# EAGLE design TSAL-GLV (EAGLE 9.4.0)
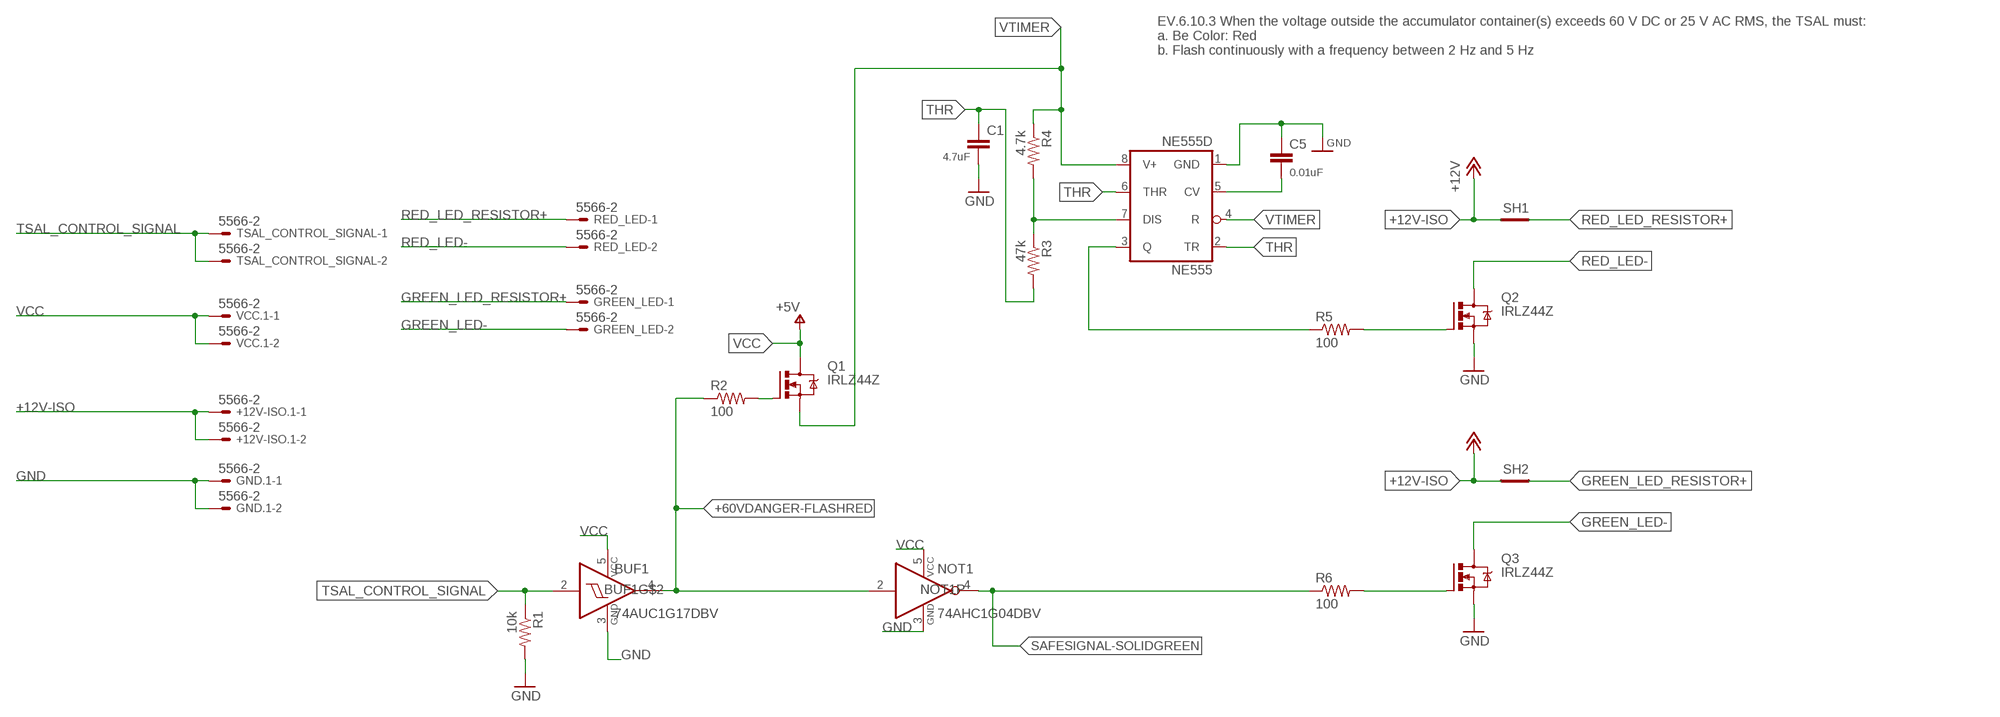
[diagram p0: schematic, sheet 1]

## Parts
+12V-ISO.1  5566-2  [5566-2]
BUF1  74AUC1G17DBV  [SOT23-5]
C1  4.7uF  C-EUC0805  [C0805]
C5  0.01uF  C-EUC0805  [C0805]
GND.1  5566-2  [5566-2]
GREEN_LED  5566-2  [5566-2]
NE555  NE555D  [SO08]
NOT1  74AHC1G04DBV  [SOT23-5]
Q1  IRLZ44Z  [TO220BH]
Q2  IRLZ44Z  [TO220BH]
Q3  IRLZ44Z  [TO220BH]
R1  10k  R-US_R0805  [R0805]
R2  100  R-US_R0805  [R0805]
R3  47k  R-US_R0805  [R0805]
R4  4.7k  R-US_R0805  [R0805]
R5  100  R-US_R0805  [R0805]
R6  100  R-US_R0805  [R0805]
RED_LED  5566-2  [5566-2]
SH1  SHORTT5  [SHORT_TOP-50]
SH2  SHORTT5  [SHORT_TOP-50]
TSAL_CONTROL_SIGNAL  5566-2  [5566-2]
VCC.1  5566-2  [5566-2]

## Nets
+12V-ISO: +12V-ISO.1.1 +12V-ISO.1.2 SH1.1 SH2.1 ; supply symbol labelled +12V
+60VDANGER-FLASHRED: BUF1.4(O) NOT1.2(I) R2.1
GND: BUF1.3(GND) C1.2 C5.1 GND.1.1 GND.1.2 NE555.1(GND) NOT1.3(GND) Q2.S Q3.S R1.2
GREEN_LED-: GREEN_LED.2 Q3.D
GREEN_LED_RESISTOR+: GREEN_LED.1 SH2.2
N$1: NE555.3(Q) R5.1
N$2: NE555.7(DIS) R3.1 R4.2
N$7: C5.2 NE555.5(CV)
N$8: Q2.G R5.2
N$11: Q1.G R2.2
N$14: Q3.G R6.2
RED_LED-: Q2.D RED_LED.2
RED_LED_RESISTOR+: RED_LED.1 SH1.2
SAFESIGNAL-SOLIDGREEN: NOT1.4(O) R6.1
THR: C1.1 NE555.2(TR) NE555.6(THR) R3.2
TSAL_CONTROL_SIGNAL: BUF1.2(I) R1.1 TSAL_CONTROL_SIGNAL.1 TSAL_CONTROL_SIGNAL.2
VCC: BUF1.5(VCC) NOT1.5(VCC) Q1.D VCC.1.1 VCC.1.2 ; supply symbol labelled +5V
VTIMER: NE555.4(R) NE555.8(V+) Q1.S R4.1

## Notes on the sheet
- EV.6.10.3 When the voltage outside the accumulator container(s) exceeds 60 V DC or 25 V AC RMS, the TSAL must:
  a. Be Color: Red
  b. Flash continuously with a frequency between 2 Hz and 5 Hz

## Library data of the parts
+12V-ISO.1 GND.1 GREEN_LED RED_LED TSAL_CONTROL_SIGNAL VCC.1 = con-molex:5566-2: Mini FIT connector 2 pol Source: http://www.molex.com; MF: MOLEX; OC_FARNELL: 1822072; OC_NEWARK: unknown
BUF1 = 74xx-little-us:74*1G17: Single Schmitt-Trigger Buffer
C1 C5 = rcl:C-EU: CAPACITOR, European symbol; SPICEPREFIX: C
NE555 = linear:*555: TIMER
NOT1 = 74xx-little-us:74*1G04: INVERTER Gate
Q1-Q3 = transistor-power:IRLZ44Z: N-Channel HEXFET® Power MOSFET Logic Level AUTOMOTIVE MOSFET Source: http://www.irf.com/product-info/datasheets/data/irlz44zpbf.pdf
R1-R6 = rcl:R-US_: RESISTOR, American symbol; SPICEPREFIX: R
SH1 SH2 = shorts:SHORT: Short between two nets; BOM: no

## Board
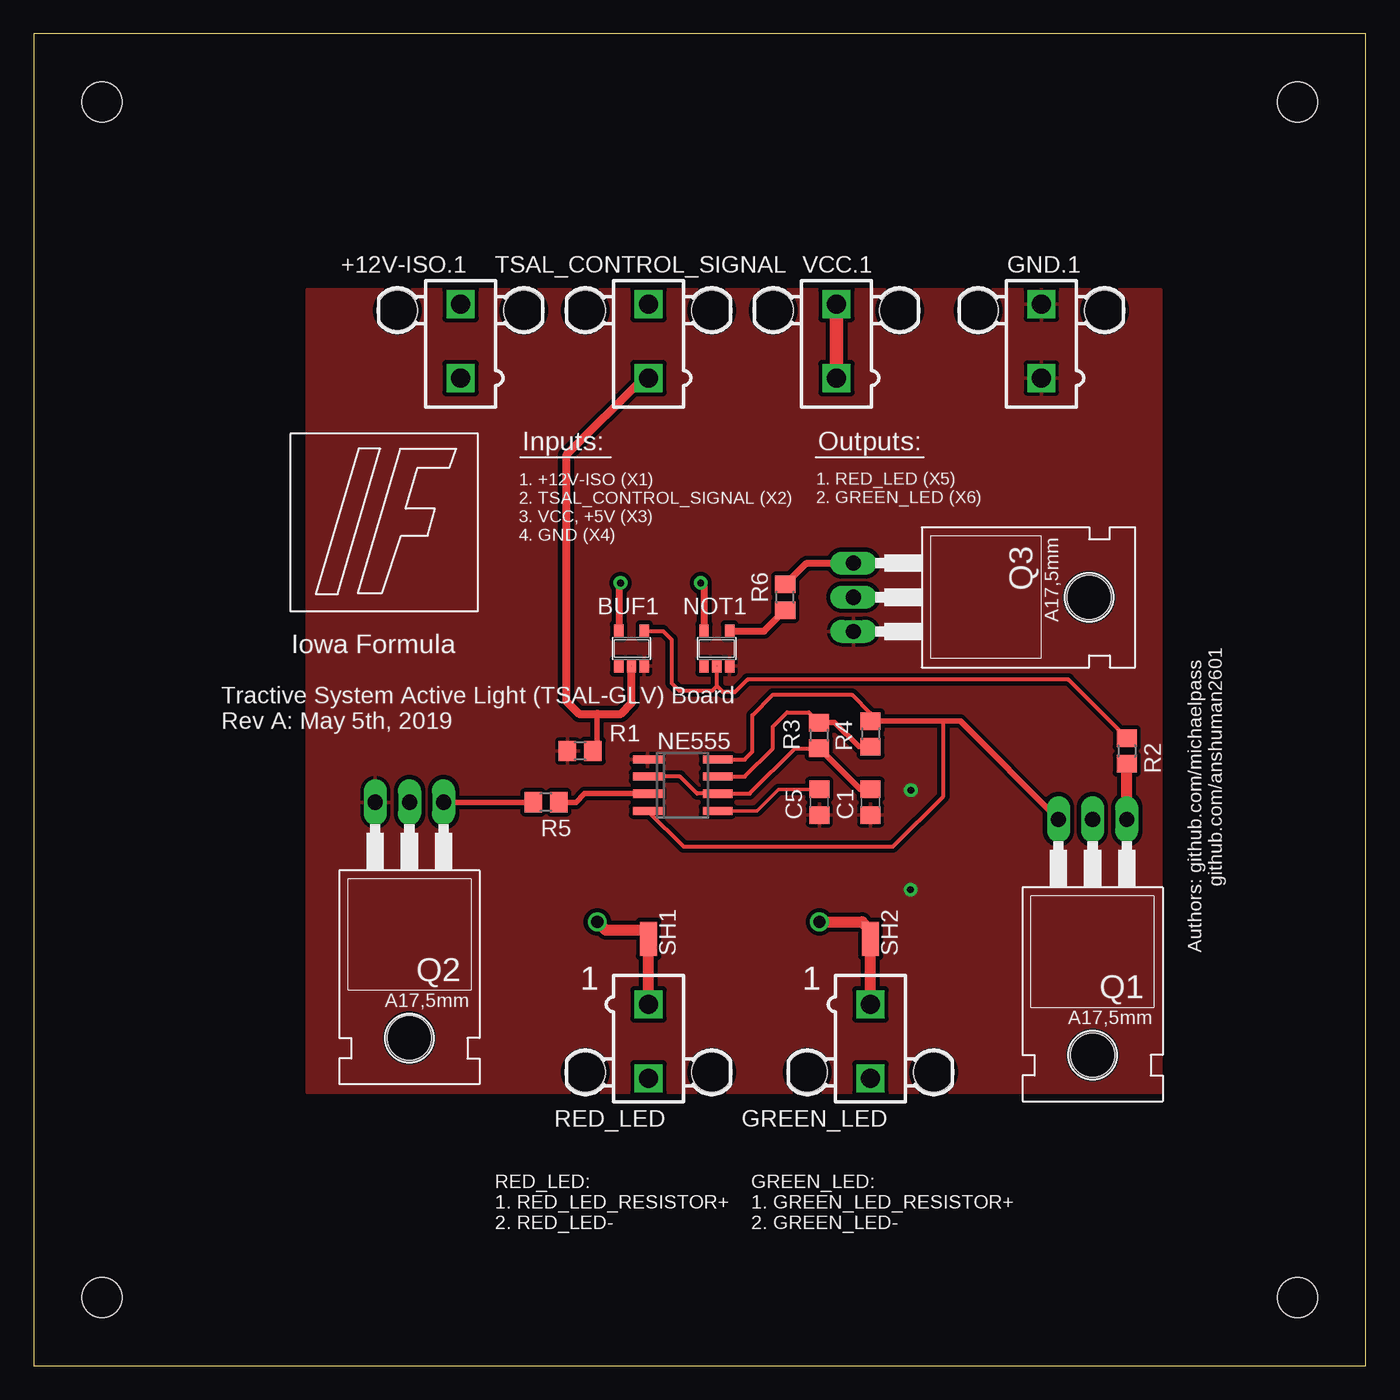
[diagram p1: board, top side]
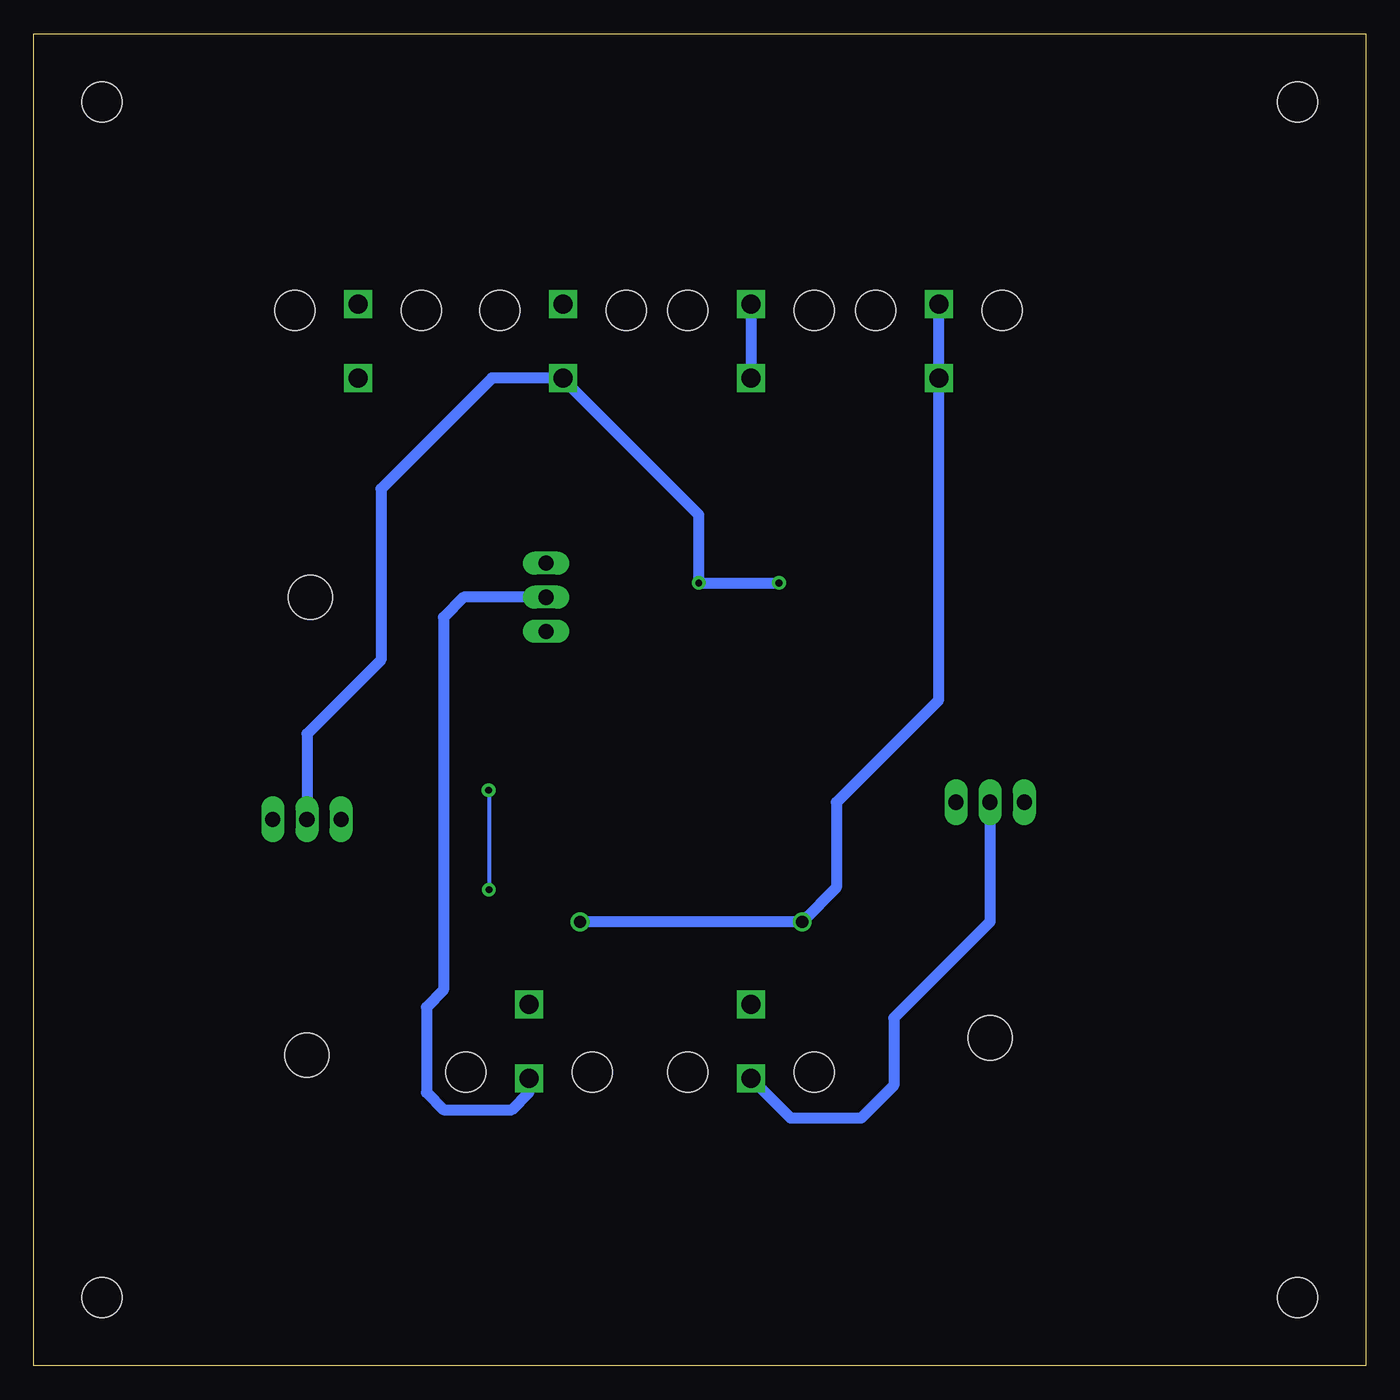
[diagram p2: board, bottom side, seen from below]

Size 99.06 x 99.06 mm. Coordinates in mm from the lower left corner, seen from the top.
Outline: 0,0 99.06,0 99.06,99.06 0,99.06 0,0
Copper layers (1*16): Top 0.035mm / dielectric 1.5mm / Bottom 0.035mm
Design rules "default *": minimum track width 8mil, minimum drill 20mil, track to track 8mil, track to pad 8mil, pad to pad 8mil, via to via 8mil, smd to smd 8mil, copper to edge 10mil, drill to drill 8mil, minimum pad ring 12mil, minimum via ring 10mil, stop-mask expansion 4mil, vias tented up to drill 25mil, thermal gap 10mil
Holes 3 mm at 5.08,93.98 93.98,93.98 93.98,5.08 5.08,5.08

### Footprints (pad centres in the part's own frame; a part is rotated, then mirrored left to right if it is on the bottom)
5566-2 = drill 1.4 square: 1 0,-2.75; 2 0,2.75 | hole 3: 4.7,2.29; -4.7,2.29
SOT23-5 = smd 0.69 x 0.99: 1 -0.95,-1.29; 2 0,-1.29; 3 0.95,-1.29; 4 0.95,1.3; 5 -0.95,1.3
C0805 = smd 1.3 x 1.5: 1 -0.95,0; 2 0.95,0
SO08 = smd 0.6 x 2.2: 1 -1.905,-2.6; 2 -0.635,-2.6; 3 0.635,-2.6; 4 1.905,-2.6; 5 1.905,2.6; 6 0.635,2.6; 7 -0.635,2.6; 8 -1.905,2.6
TO220BH = drill 1.118 long: D 0,-6.35; G -2.54,-6.35; S 2.54,-6.35 | hole 3.302: 0,11.176
R0805 = smd 1.3 x 1.5: 1 -0.95,0; 2 0.95,0
SHORT_TOP-50 = smd 1.27 x 1.27: 1 0.635,0; 2 -0.635,0

### Placement (x,y rotation side)
+12V-ISO.1  31.75,76.2 0 top
BUF1  44.45,53.34 0 top
C1  62.23,41.91 270 top
C5  58.42,41.91 90 top
GND.1  74.93,76.2 0 top
GREEN_LED  62.23,24.13 180 top
NE555  48.26,43.18 270 top
NOT1  50.8,53.34 0 top
Q1  78.74,34.29 180 top
Q2  27.94,35.56 180 top
Q3  67.31,57.15 270 top
R1  40.64,45.72 180 top
R2  81.28,45.72 270 top
R3  58.39,46.89 270 top
R4  62.23,46.99 270 top
R5  38.1,41.91 180 top
R6  55.88,57.15 90 top
RED_LED  45.72,24.13 180 top
SH1  45.72,31.75 90 top
SH2  62.23,31.75 90 top
TSAL_CONTROL_SIGNAL  45.72,76.2 0 top
VCC.1  59.69,76.2 0 top

### Tracks (layer width: path | path; a pad name or v marks a point on that pad's centre or on a via)
+12V-ISO  (via drill 0.9)
  Top 0.813: SH1.1 42.55,32.38 v41.91,33.02 | v58.42,33.02 61.59,33.02 SH2.1
  Bottom 0.813: v58.42,33.02 v41.91,33.02 39.37,35.56 39.37,41.91 31.75,49.53 +12V-ISO.1.1 +12V-ISO.1.2
+60VDANGER-FLASHRED
  Top 0.305: BUF1.4 46.81,54.64 47.45,54 47.45,50.77 48.01,50.22 50.47,50.22 50.8,50.55 | 50.8,50.55 NOT1.2 | R2.1 76.92,51.03 53.09,51.03 52.15,50.09 51.26,50.09 50.8,50.55
GND  (via drill 0.51)
  Bottom 0.305: v65.23,42.8 65.2,42.77 v65.2,35.41
  pour Top (isolate 0.305): 20.32,20.32 83.82,20.32 83.82,80.01 20.32,80.01
GREEN_LED-
  Bottom 0.813: Q3.D 67.08,57.15 68.58,55.65 68.58,27.94 69.85,26.67 69.85,20.32 68.58,19.05 63.5,19.05 62.23,20.32 GREEN_LED.2
GREEN_LED_RESISTOR+
  Top 0.813: GREEN_LED.1 SH2.2
N$1
  Top 0.406: NE555.3 40.95,42.55 40.32,41.91 R5.1
N$2
  Top 0.305: NE555.7 52.86,43.81 54.97,45.92 54.97,47.52 56.03,48.59 57.64,48.59 R3.1
  Top 0.406: R3.1 59.55,47.84 61.35,46.04 R4.2
N$7
  Top 0.254: C5.2 55.38,42.86 53.8,41.27 NE555.5
N$8
  Top 0.406: Q2.G R5.2
N$11
  Top 0.813: Q1.G R2.2
N$14
  Top 0.508: R6.2 57.47,59.69 Q3.G
RED_LED-
  Bottom 0.813: Q2.D 27.94,33.02 35.1,25.86 35.1,20.85 37.54,18.41 42.76,18.41 RED_LED.2
RED_LED_RESISTOR+
  Top 0.813: RED_LED.1 SH1.2
SAFESIGNAL-SOLIDGREEN
  Top 0.508: NOT1.4 54.32,54.64 R6.1
THR
  Top 0.305: NE555.2 48.06,43.81 49.33,42.55 NE555.6 53.24,42.55 56.62,45.92 58.38,45.92 R3.2
  Top 0.406: R3.2 61.47,42.86 C1.1
TSAL_CONTROL_SIGNAL
  Top 0.406: 41.91,48.49 41.91,46.04 R1.1
  Top 0.61: TSAL_CONTROL_SIGNAL.1 45.33,73.45 39.6,67.72 39.6,49.45 40.56,48.49 41.91,48.49 43.66,48.49 44.47,49.3 44.47,52.03 BUF1.2
  Bottom 0.813: TSAL_CONTROL_SIGNAL.2 TSAL_CONTROL_SIGNAL.1
VCC  (via drill 0.51)
  Top 0.508: NOT1.5 49.86,57.96 v49.61,58.22 | v43.64,58.22 43.51,58.09 BUF1.5
  Top 1.016: VCC.1.2 VCC.1.1
  Bottom 0.813: Q1.D 78.74,46.99 73.23,52.5 73.23,65.2 64.98,73.45 VCC.1.1 59.69,73.38 49.61,63.3 v49.61,58.22 v43.64,58.22
VTIMER
  Top 0.305: NE555.8 52.86,45.09 53.44,45.67 53.44,48.36 54.99,49.91 60.83,49.91 62.23,48.51 R4.1 | NE555.4 48.33,38.61 63.88,38.61 67.63,42.36 67.63,47.94
  Top 0.406: R4.1 67.63,47.94 68.9,47.94 Q1.S

### Text on the board
tNames: Inputs: | Outputs: | 1. RED_LED (X5) / 2. GREEN_LED (X6) | 1. +12V-ISO (X1) / 2. TSAL_CONTROL_SIGNAL (X2) / 3. VCC, +5V (X3) / 4. GND (X4) | Iowa Formula | Tractive System Active Light (TSAL-GLV) Board / Rev A: May 5th, 2019 | Authors: github.com/michaelpass / github.com/anshuman2601 | 1 | 1 | RED_LED: / 1. RED_LED_RESISTOR+ / 2. RED_LED- | GREEN_LED: / 1. GREEN_LED_RESISTOR+ / 2. GREEN_LED-